# Altium schematic sheet raspberry_pi.SchDoc
size A
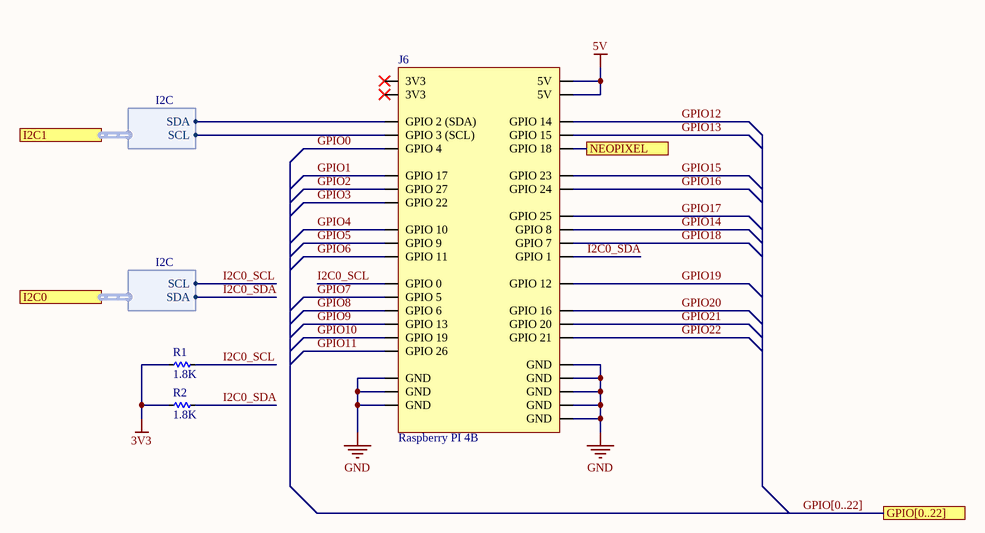
[diagram p0: raspberry_pi.SchDoc]

## Parts
J6  Raspberry PI 4B  [Raspberry PI 4B]
R1  value 1.8K  [R1206]  (hidden comment: __Template_Resistor)
R2  value 1.8K  [R1206]  (hidden comment: __Template_Resistor)

## Ports
GPIO[0..22], I2C0 (harness I2C), I2C1 (harness I2C), NEOPIXEL

## Harnesses
I2C: SDA, SCL

## Nets
3V3: R1.1 R2.1
5V: J6.2(5V) J6.4(5V)
GND: J6.6(GND) J6.9(GND) J6.14(GND) J6.20(GND) J6.25(GND) J6.30(GND) J6.34(GND) J6.39(GND)
GPIO0: J6.7(GPIO_4)
GPIO1: J6.11(GPIO_17)
GPIO2: J6.13(GPIO_27)
GPIO3: J6.15(GPIO_22)
GPIO4: J6.19(GPIO_10)
GPIO5: J6.21(GPIO_9)
GPIO6: J6.23(GPIO_11)
GPIO7: J6.29(GPIO_5)
GPIO8: J6.31(GPIO_6)
GPIO9: J6.33(GPIO_13)
GPIO10: J6.35(GPIO_19)
GPIO11: J6.37(GPIO_26)
GPIO12: J6.8(GPIO_14)
GPIO13: J6.10(GPIO_15)
GPIO14: J6.24(GPIO_8)
GPIO15: J6.16(GPIO_23)
GPIO16: J6.18(GPIO_24)
GPIO17: J6.22(GPIO_25)
GPIO18: J6.26(GPIO_7)
GPIO19: J6.32(GPIO_12)
GPIO20: J6.36(GPIO_16)
GPIO21: J6.38(GPIO_20)
GPIO22: J6.40(GPIO_21)
I2C0_SCL: J6.27(GPIO_0) R1.2 ; port I2C0.SCL
I2C0_SDA: J6.28(GPIO_1) R2.2 ; port I2C0.SDA
NEOPIXEL: J6.12(GPIO_18) ; port NEOPIXEL
NetJ6_3: J6.3(GPIO_2_(SDA)) ; port I2C1.SDA
NetJ6_5: J6.5(GPIO_3_(SCL)) ; port I2C1.SCL

Not connected (* = marked no-connect by the designer): J6 1(3V3)* 17(3V3)*

## Buses and harness runs
bus GPIO[0..22] = port GPIO[0..22]

## Library data of the parts
R1 R2 = 3502: Resistor, 1.80K Ohms, 1206, 0.25W, ±1%; ID: 3502; MFG: YAGEO; MFG P/N: RC1206FR-071K8L; Power: 1/4W; COMMON: 470-06908-00; XPN: XS-10017648; Status: Released; Package: 1206; Tolerance: 1%; Height: 0.65mm; Supplier 1: Digi-Key; LOON: 470-06908-00; Gecko: 470-06908-00; Supplier Part Number 1: 311-1.80KFRCT-ND